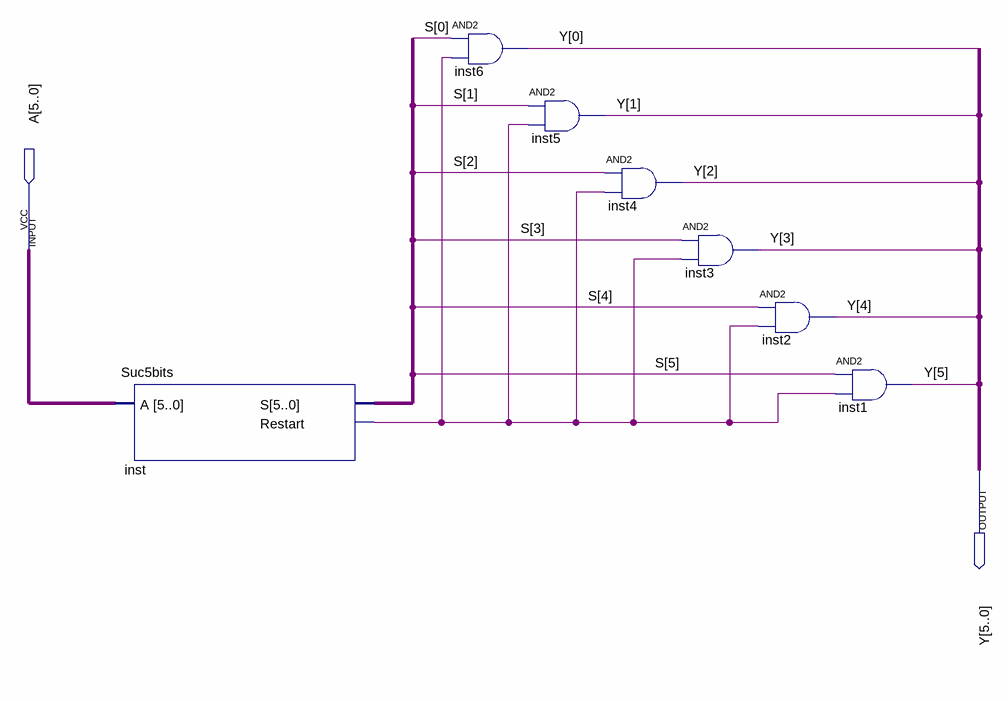
[diagram p0: schematic sheet]
// Quartus schematic Suc5bits(R).bdf as structural Verilog: 7 symbols, 2 pins
module \Suc5bits(R)  (
  input  [5:0] A,
  output [5:0] Y
);

  wire inst_restart;
  wire [5:0] inst_s, S;

  Suc5bits inst (.A(A), .S(inst_s), .Restart(inst_restart));
  and inst6 (Y[0], S[0], inst_restart);
  and inst5 (Y[1], S[1], inst_restart);
  and inst4 (Y[2], S[2], inst_restart);
  and inst3 (Y[3], S[3], inst_restart);
  and inst2 (Y[4], S[4], inst_restart);
  and inst1 (Y[5], S[5], inst_restart);
endmodule
